# Altium schematic sheet connectors-interface.SchDoc
size A3; DocumentNumber: 12; SheetNumber: 12; SheetTotal: 45; SheetDescription: Connector to Interface Board
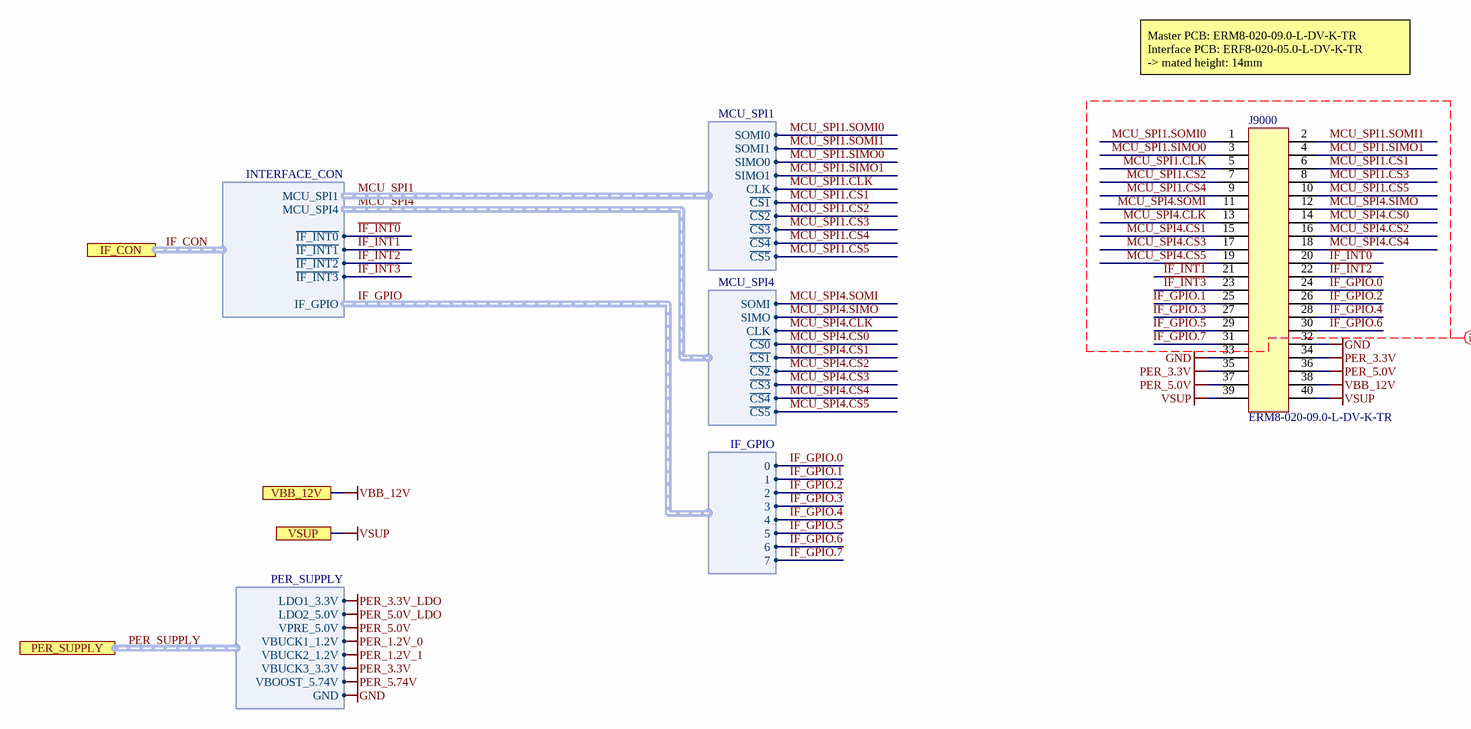
[diagram p0: connectors-interface.SchDoc]

## Parts
J9000  ERM8-020-09.0-L-DV-K-TR  [SAMTEC_ERM8-020-09.0-L-DV-K]

## Ports
IF_CON (harness INTERFACE_CON), PER_SUPPLY (harness PER_SUPPLY), VBB_12V, VSUP

## Harnesses
MCU_SPI1: CLK, SIMO0, SOMI0, SOMI1, ~{CS1}, ~{CS2}, ~{CS3}, ~{CS4}, ~{CS5}, SIMO1
MCU_SPI4: CLK, SIMO, SOMI, ~{CS1}, ~{CS2}, ~{CS3}, ~{CS0}, ~{CS4}, ~{CS5}
IF_GPIO: 0, 1, 2, 3, 4, 5, 6, 7
PER_SUPPLY: GND, VBOOST_5.74V, LDO1_3.3V, LDO2_5.0V, VPRE_5.0V, VBUCK1_1.2V, VBUCK2_1.2V, VBUCK3_3.3V
INTERFACE_CON: MCU_SPI1, MCU_SPI4, ~{IF_INT0}, ~{IF_INT1}, ~{IF_INT2}, ~{IF_INT3}, IF_GPIO

## Nets
GND: J9000.32 J9000.33 ; port PER_SUPPLY.GND  [project net PER_SUPPLY.GND]
PER_1.2V_0: port PER_SUPPLY.VBUCK1_1.2V  [project net PER_SUPPLY.VBUCK1_1.2V]
PER_1.2V_1: port PER_SUPPLY.VBUCK2_1.2V  [project net PER_SUPPLY.VBUCK2_1.2V]
PER_3.3V: J9000.34 J9000.35 ; port PER_SUPPLY.VBUCK3_3.3V  [project net PER_SUPPLY.VBUCK3_3.3V]
PER_3.3V_LDO: port PER_SUPPLY.LDO1_3.3V  [project net PER_SUPPLY.LDO1_3.3V]
PER_5.0V: J9000.36 J9000.37 ; port PER_SUPPLY.VPRE_5.0V  [project net PER_SUPPLY.VPRE_5.0V]
PER_5.0V_LDO: port PER_SUPPLY.LDO2_5.0V  [project net PER_SUPPLY.LDO2_5.0V]
PER_5.74V: port PER_SUPPLY.VBOOST_5.74V  [project net PER_SUPPLY.VBOOST_5.74V]
VBB_12V: J9000.38 ; port VBB_12V
VSUP: J9000.39 J9000.40 ; port VSUP
~{IF_INT0}: J9000.20 ; port IF_CON.~{IF_INT0}
~{IF_INT1}: J9000.21 ; port IF_CON.~{IF_INT1}
~{IF_INT2}: J9000.22 ; port IF_CON.~{IF_INT2}
~{IF_INT3}: J9000.23 ; port IF_CON.~{IF_INT3}
~{MCU_SPI1.CS1}: J9000.6 ; harness MCU_SPI1.~{CS1}
~{MCU_SPI1.CS2}: J9000.7 ; harness MCU_SPI1.~{CS2}
~{MCU_SPI1.CS3}: J9000.8 ; harness MCU_SPI1.~{CS3}
~{MCU_SPI1.CS4}: J9000.9 ; harness MCU_SPI1.~{CS4}
~{MCU_SPI1.CS5}: J9000.10 ; harness MCU_SPI1.~{CS5}
~{MCU_SPI4.CS0}: J9000.14 ; harness MCU_SPI4.~{CS0}
~{MCU_SPI4.CS1}: J9000.15 ; harness MCU_SPI4.~{CS1}
~{MCU_SPI4.CS2}: J9000.16 ; harness MCU_SPI4.~{CS2}
~{MCU_SPI4.CS3}: J9000.17 ; harness MCU_SPI4.~{CS3}
~{MCU_SPI4.CS4}: J9000.18 ; harness MCU_SPI4.~{CS4}
~{MCU_SPI4.CS5}: J9000.19 ; harness MCU_SPI4.~{CS5}
IF_GPIO.0: J9000.24 ; harness IF_GPIO.0
IF_GPIO.1: J9000.25 ; harness IF_GPIO.1
IF_GPIO.2: J9000.26 ; harness IF_GPIO.2
IF_GPIO.3: J9000.27 ; harness IF_GPIO.3
IF_GPIO.4: J9000.28 ; harness IF_GPIO.4
IF_GPIO.5: J9000.29 ; harness IF_GPIO.5
IF_GPIO.6: J9000.30 ; harness IF_GPIO.6
IF_GPIO.7: J9000.31 ; harness IF_GPIO.7
MCU_SPI1.CLK: J9000.5 ; harness MCU_SPI1.CLK
MCU_SPI1.SIMO0: J9000.3 ; harness MCU_SPI1.SIMO0
MCU_SPI1.SIMO1: J9000.4 ; harness MCU_SPI1.SIMO1
MCU_SPI1.SOMI0: J9000.1 ; harness MCU_SPI1.SOMI0
MCU_SPI1.SOMI1: J9000.2 ; harness MCU_SPI1.SOMI1
MCU_SPI4.CLK: J9000.13 ; harness MCU_SPI4.CLK
MCU_SPI4.SIMO: J9000.12 ; harness MCU_SPI4.SIMO
MCU_SPI4.SOMI: J9000.11 ; harness MCU_SPI4.SOMI

## Buses and harness runs
harness IF_CON = port IF_CON
harness PER_SUPPLY = port PER_SUPPLY

## Layout directives
net class CON_IF: IF_GPIO.0, IF_GPIO.1, IF_GPIO.2, IF_GPIO.3, IF_GPIO.4, IF_GPIO.5, IF_GPIO.6, IF_GPIO.7, MCU_SPI1.CLK, MCU_SPI1.SIMO0, MCU_SPI1.SIMO1, MCU_SPI1.SOMI0, MCU_SPI1.SOMI1, MCU_SPI4.CLK, MCU_SPI4.SIMO, MCU_SPI4.SOMI, ~{IF_INT0}, ~{IF_INT1}, ~{IF_INT2}, ~{IF_INT3}, ~{MCU_SPI1.CS1}, ~{MCU_SPI1.CS2}, ~{MCU_SPI1.CS3}, ~{MCU_SPI1.CS4}, ~{MCU_SPI1.CS5}, ~{MCU_SPI4.CS0}, ~{MCU_SPI4.CS1}, ~{MCU_SPI4.CS2}, ~{MCU_SPI4.CS3}, ~{MCU_SPI4.CS4}, ~{MCU_SPI4.CS5}

## Notes on the sheet
- Master PCB: ERM8-020-09.0-L-DV-K-TR
  Interface PCB: ERF8-020-05.0-L-DV-K-TR
  -> mated height: 14mm
- Fraunhofer IISB
- Schottkystr. 10
- developed by:
- 91058 Erlangen
- Germany
- Author
- Project
- License
- Description
- File
- Version
- Release Date
- Sheet
- foxbms.org <https://foxbms.org>
- www.iisb.fraunhofer.de <https://www.iisb.fraunhofer.de/>
- foxBMS Team
- /

## Library data of the parts
J9000 = SAMTEC_ERM8-020-09.0-L-DV-K-TR: Edge Rate rugged high-speed connector strips; Manufacturer: Samtec; Circuits: 40; Automotive Qualified: False; Part Number: SAMTEC_ERM8-020-09.0-L-DV-K-TR; Part Name: ERM8-020-09.0-L-DV-K-TR; Operating Temperature: -55°C - +125°C; ComponentLink1Description: Datasheet; ComponentLink1URL: https://suddendocs.samtec.com/catalog_english/erm8.pdf; Supplier 1: Farnell; Supplier Part Number 1: 3551150; Supplier 2: Samtec; Supplier Part Number 2: ERM8-020-09.0-L-DV-K-TR; Supplier 3: RS Components; Supplier Part Number 3: 1798876; ECCN: EAR99; System: Connector